# Altium schematic sheet NGUYENLYSANPHAMBAOTRAN.SchDoc
size A2; SheetNumber: 1; SheetTotal: 1
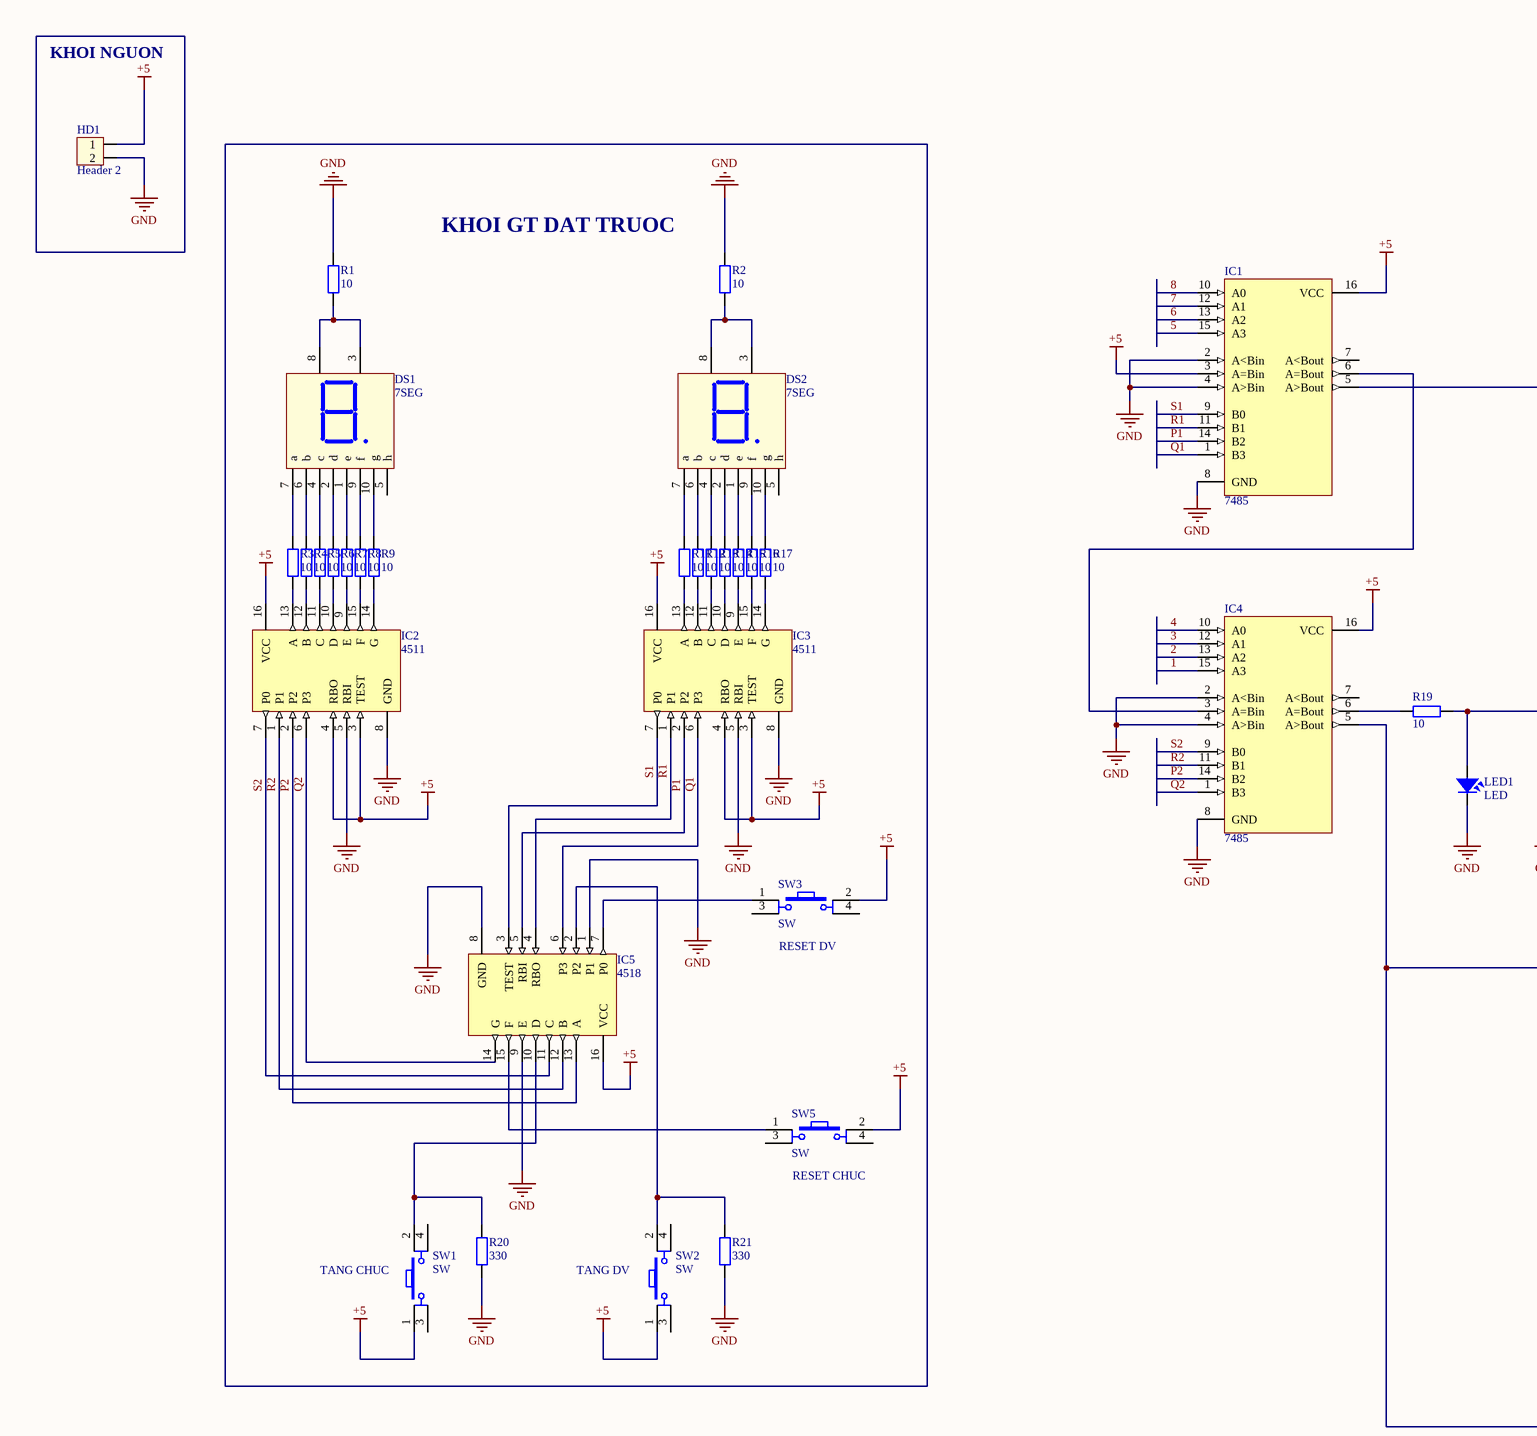
[diagram p0: NGUYENLYSANPHAMBAOTRAN.SchDoc, left]
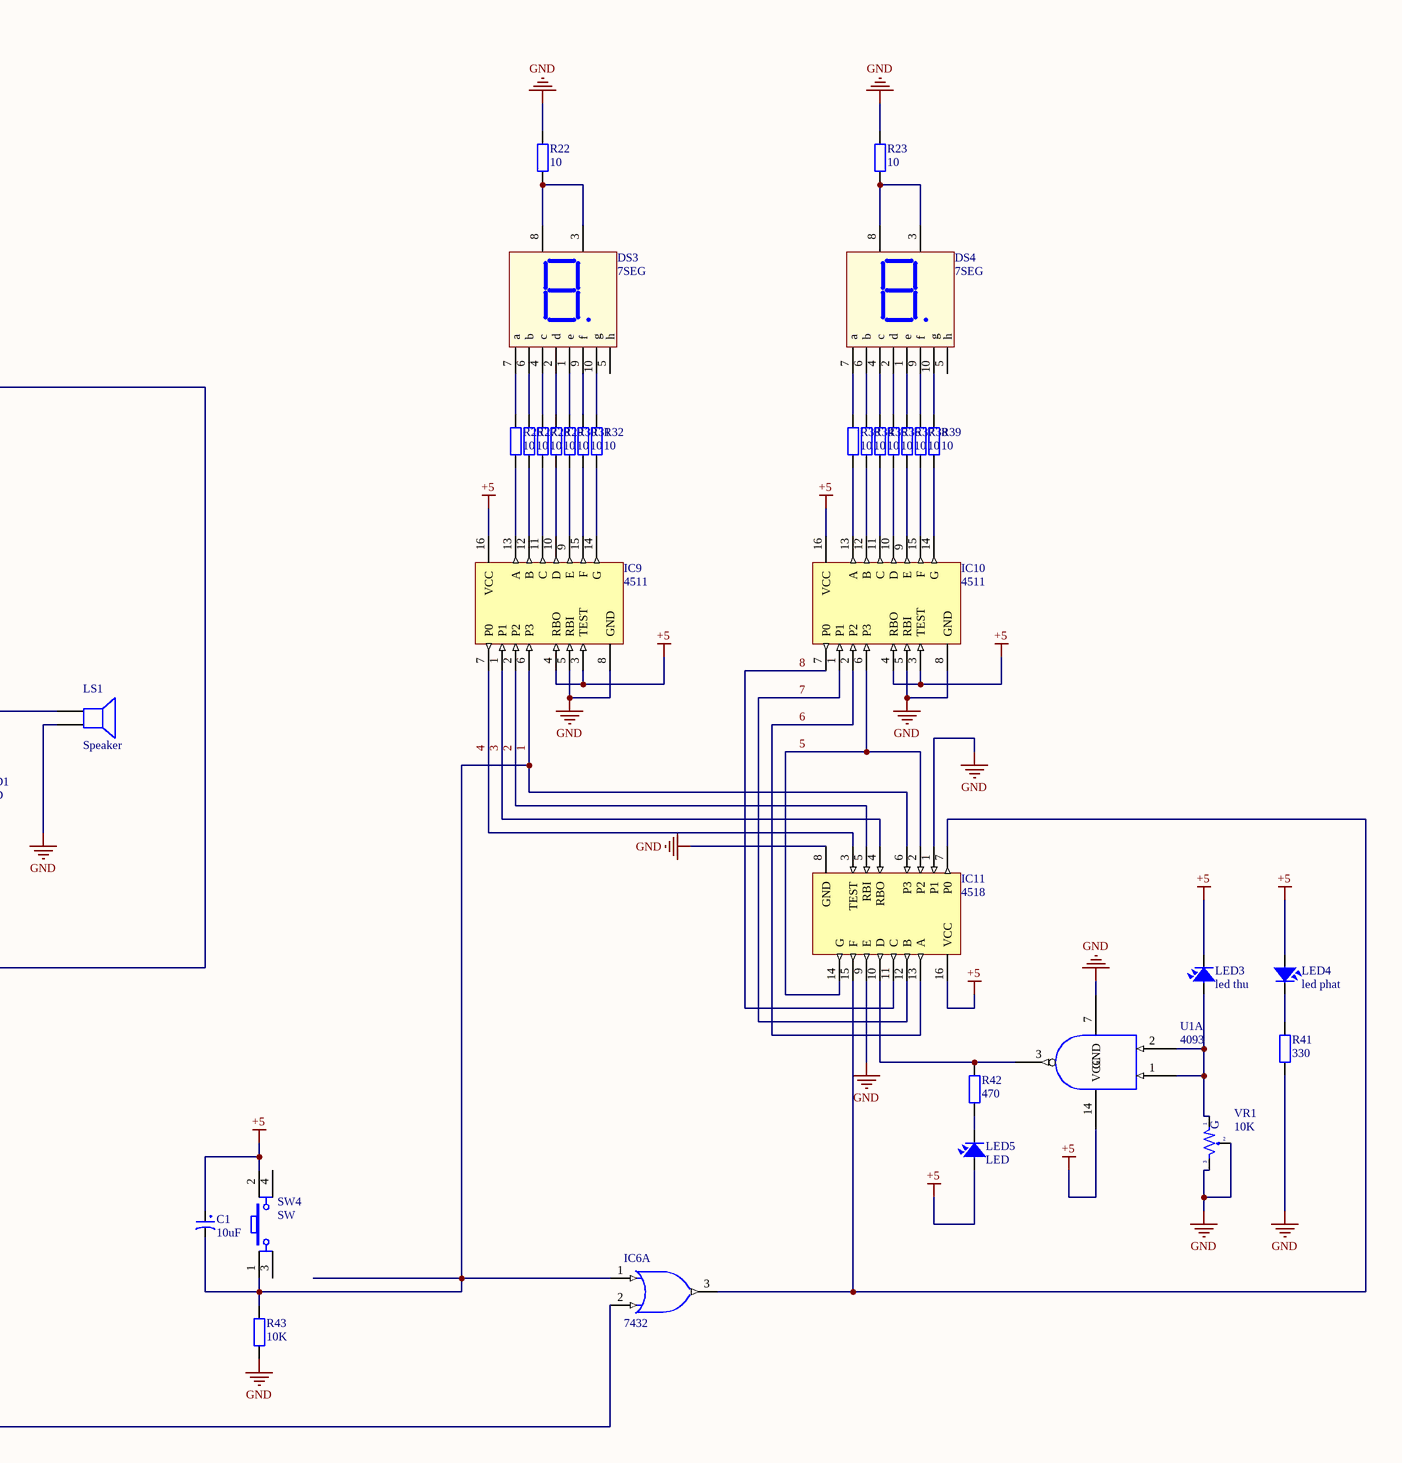
[diagram p1: NGUYENLYSANPHAMBAOTRAN.SchDoc, right]

## Parts
C1  10uF  [tu hoa 4mm]
DS1  7SEG  [LED7SEG-1-0.56]
DS2  7SEG  [LED7SEG-1-0.56]
DS3  7SEG  [LED7SEG-1-0.56]
DS4  7SEG  [LED7SEG-1-0.56]
HD1  Header 2  [HED2]
IC1  7485  [DIP16/W0.3]
IC2  4511  [DIP16]
IC3  4511  [DIP16]
IC4  7485  [DIP16/W0.3]
IC5  4518  [DIP16]
IC6  7432  [DIP14/W0.3]  (part A of 4)
IC9  4511  [DIP16]
IC10  4511  [DIP16]
IC11  4518  [DIP16]
LED1  LED  [LED-3]
LED3  led thu  [LED-3]
LED4  led phat  [LED-3]
LED5  LED  [LED-3]
LS1  Speaker  [SPEAKER]
R1  10  [R1/4W]
R2  10  [R1/4W]
R3  10  [R1/4W]
R4  10  [R1/4W]
R5  10  [R1/4W]
R6  10  [R1/4W]
R7  10  [R1/4W]
R8  10  [R1/4W]
R9  10  [R1/4W]
R11  10  [R1/4W]
R12  10  [R1/4W]
R13  10  [R1/4W]
R14  10  [R1/4W]
R15  10  [R1/4W]
R16  10  [R1/4W]
R17  10  [R1/4W]
R19  10  [R1/4W]
R20  330  [R1/4W]
R21  330  [R1/4W]
R22  10  [R1/4W]
R23  10  [R1/4W]
R26  10  [R1/4W]
R27  10  [R1/4W]
R28  10  [R1/4W]
R29  10  [R1/4W]
R30  10  [R1/4W]
R31  10  [R1/4W]
R32  10  [R1/4W]
R33  10  [R1/4W]
R34  10  [R1/4W]
R35  10  [R1/4W]
R36  10  [R1/4W]
R37  10  [R1/4W]
R38  10  [R1/4W]
R39  10  [R1/4W]
R41  330  [R1/4W]
R42  470  [R1/4W]
R43  10K  [R1/4W]
SW1  SW  [SW4]
SW2  SW  [SW4]
SW3  SW  [SW4]
SW4  SW  [SW4]
SW5  SW  [SW4]
U1  4093  [DIP14]  (part A of 4)
VR1  10K  [VR-S1]

## Nets
+5: C1.1 HD1.1 IC1.3(A=Bin) IC1.16(VCC) IC2.3(TEST) IC2.4(RBO) IC2.16(VCC) IC3.3(TEST) IC3.4(RBO) IC3.16(VCC) IC4.16(VCC) IC5.16(VCC) IC9.3(TEST) IC9.4(RBO) IC9.16(VCC) IC10.3(TEST) IC10.4(RBO) IC10.16(VCC) IC11.16(VCC) LED3.2 LED4.1 LED5.1 SW1.1 SW2.1 SW3.2 SW4.2 SW5.2 U1.14(VCC)
GND: HD1.2 IC1.2(A<Bin) IC1.4(A>Bin) IC1.8(GND) IC2.5(RBI) IC2.8(GND) IC3.5(RBI) IC3.8(GND) IC4.2(A<Bin) IC4.4(A>Bin) IC4.8(GND) IC5.1(P1) IC5.8(GND) IC5.9(E) IC6.7(GND) IC9.5(RBI) IC9.8(GND) IC10.5(RBI) IC10.8(GND) IC11.1(P1) IC11.8(GND) IC11.9(E) LED1.2 LS1.2 R1.2 R2.2 R20.1 R21.1 R22.2 R23.2 R41.1 R43.2 U1.7(GND) VR1.2 VR1.3
VCC: IC6.14(VCC)
1: C1.2 IC4.15(A3) IC6.1(A) IC9.6(P3) IC11.6(P3) R43.1 SW4.1
2: IC4.13(A2) IC9.2(P2) IC11.5(RBI)
3: IC4.12(A1) IC9.1(P1) IC11.4(RBO)
4: IC4.10(A0) IC9.7(P0) IC11.3(TEST)
5: IC1.15(A3) IC10.6(P3) IC11.2(P2) IC11.14(G)
6: IC1.13(A2) IC10.2(P2) IC11.13(A)
7: IC1.12(A1) IC10.1(P1) IC11.12(B)
8: IC1.10(A0) IC10.7(P0) IC11.11(C)
P1: IC1.14(B2) IC3.2(P2) IC5.5(RBI)
P2: IC2.2(P2) IC4.14(B2) IC5.13(A)
Q1: IC1.1(B3) IC3.6(P3) IC5.6(P3)
Q2: IC2.6(P3) IC4.1(B3) IC5.14(G)
R1: IC1.11(B1) IC3.1(P1) IC5.4(RBO)
R2: IC2.1(P1) IC4.11(B1) IC5.12(B)
S1: IC1.9(B0) IC3.7(P0) IC5.3(TEST)
S2: IC2.7(P0) IC4.9(B0) IC5.11(C)
NetDS1_1: DS1.1(e) R7.2
NetDS1_2: DS1.2(d) R6.2
NetDS1_3: DS1.3(Vcc) DS1.8(Vcc) R1.1
NetDS1_4: DS1.4(c) R5.2
NetDS1_6: DS1.6(b) R4.2
NetDS1_7: DS1.7(a) R3.2
NetDS1_9: DS1.9(f) R8.2
NetDS1_10: DS1.10(g) R9.2
NetDS2_1: DS2.1(e) R15.2
NetDS2_2: DS2.2(d) R14.2
NetDS2_3: DS2.3(Vcc) DS2.8(Vcc) R2.1
NetDS2_4: DS2.4(c) R13.2
NetDS2_6: DS2.6(b) R12.2
NetDS2_7: DS2.7(a) R11.2
NetDS2_9: DS2.9(f) R16.2
NetDS2_10: DS2.10(g) R17.2
NetDS3_1: DS3.1(e) R30.2
NetDS3_2: DS3.2(d) R29.2
NetDS3_3: DS3.3(Vcc) DS3.8(Vcc) R22.1
NetDS3_4: DS3.4(c) R28.2
NetDS3_6: DS3.6(b) R27.2
NetDS3_7: DS3.7(a) R26.2
NetDS3_9: DS3.9(f) R31.2
NetDS3_10: DS3.10(g) R32.2
NetDS4_1: DS4.1(e) R37.2
NetDS4_2: DS4.2(d) R36.2
NetDS4_3: DS4.3(Vcc) DS4.8(Vcc) R23.1
NetDS4_4: DS4.4(c) R35.2
NetDS4_6: DS4.6(b) R34.2
NetDS4_7: DS4.7(a) R33.2
NetDS4_9: DS4.9(f) R38.2
NetDS4_10: DS4.10(g) R39.2
NetIC1_5: IC1.5(A>Bout) IC4.5(A>Bout) IC6.2(B)
NetIC1_6: IC1.6(A=Bout) IC4.3(A=Bin)
NetIC2_9: IC2.9(E) R7.1
NetIC2_10: IC2.10(D) R6.1
NetIC2_11: IC2.11(C) R5.1
NetIC2_12: IC2.12(B) R4.1
NetIC2_13: IC2.13(A) R3.1
NetIC2_14: IC2.14(G) R9.1
NetIC2_15: IC2.15(F) R8.1
NetIC3_9: IC3.9(E) R15.1
NetIC3_10: IC3.10(D) R14.1
NetIC3_11: IC3.11(C) R13.1
NetIC3_12: IC3.12(B) R12.1
NetIC3_13: IC3.13(A) R11.1
NetIC3_14: IC3.14(G) R17.1
NetIC3_15: IC3.15(F) R16.1
NetIC4_6: IC4.6(A=Bout) R19.2
NetIC5_2: IC5.2(P2) R21.2 SW2.2
NetIC5_7: IC5.7(P0) SW3.1
NetIC5_10: IC5.10(D) R20.2 SW1.2
NetIC5_15: IC5.15(F) SW5.1
NetIC6_3: IC6.3(Y) IC11.7(P0) IC11.15(F)
NetIC9_9: IC9.9(E) R30.1
NetIC9_10: IC9.10(D) R29.1
NetIC9_11: IC9.11(C) R28.1
NetIC9_12: IC9.12(B) R27.1
NetIC9_13: IC9.13(A) R26.1
NetIC9_14: IC9.14(G) R32.1
NetIC9_15: IC9.15(F) R31.1
NetIC10_9: IC10.9(E) R37.1
NetIC10_10: IC10.10(D) R36.1
NetIC10_11: IC10.11(C) R35.1
NetIC10_12: IC10.12(B) R34.1
NetIC10_13: IC10.13(A) R33.1
NetIC10_14: IC10.14(G) R39.1
NetIC10_15: IC10.15(F) R38.1
NetIC11_10: IC11.10(D) R42.2 U1.3
NetLED1_1: LED1.1 LS1.1 R19.1
NetLED3_1: LED3.1 U1.1 U1.2 VR1.1
NetLED4_2: LED4.2 R41.2
NetLED5_2: LED5.2 R42.1

Not connected (* = marked no-connect by the designer): DS1 5(h); DS2 5(h); DS3 5(h); DS4 5(h); IC1 7(A<Bout); IC4 7(A<Bout); SW1 3 4; SW2 3 4; SW3 3 4; SW4 3 4; SW5 3 4

## Notes on the sheet
- KHOI NGUON
- KHOI GT DAT TRUOC
- (near SW3) RESET DV
- (near SW5) RESET CHUC
- (near SW1) TANG CHUC
- (near SW2) TANG DV
- (in symbol VR-S) G

## Library data of the parts
C1 = Tu Hoa 10uF 25V 4x7: Cắm; So_Chan: 2; Ten_Linh_Kien: Tụ Hóa 10uF 25V 4x7MM; Don_Vi: Con; Ma_Hang: MH001349; Chung_Loai: Cắm; Kieu_Chan: *
DS1-DS4 = LED7SEG-1: 14.2 mm General Purpose Blue 7-Segment Display: CC, RH DP, Gray Surface; MinimumIntensity: 2020 ucd; Note: IF = 10 mA; Published: 8-Jun-2000; LatestRevisionDate: 17-Dec-2003; LatestRevisionNote: Schematic revised, PCB Footprint replaced.; DatasheetDocument: 24-Sep-2002; PackageDocument: 24-Sep-2002; PackageReference: H; Publisher: Altium Limited; Colour: Blue; ComponentLink1Description: Manufacturer Link; ComponentLink1URL: http://www.agilent.com/
HD1 = Hed2: Header 2 (Green); Value: Header 2
IC1 IC4 = 7485: 4-Bit Magnitude Comparator; Copyright by: VanDungEvn@Gmail.com; Value: 7485
IC2 IC3 IC5 IC9-IC11 = 74247: Value: 74LS238; Copyright by: VanDungEvn@Gmail.com
IC6 = 7432: Quad 2-Input OR Gate
LED1 LED3-LED5 = LED: LED Single colour Green and Red; Value: LED 3 ly Single Colour
LS1 = Speaker: Loudspeaker; Published: 24-Mar-1999; LatestRevisionDate: 17-Jul-2002; LatestRevisionNote: Re-released for DXP Platform.; PackageReference: PIN2; Publisher: Altium Limited
R1-R9 R11-R17 R19-R23 R26-R39 R41-R43 = R1/4W: Resistor 1/4W; Value: R1/4W - 1K
SW1-SW5 = SW4: Switch button 4 pin; Value: Button chip 4 pin
U1 = 4093: Quad 2-INPUT NAND SCHMITT TRIGGER
VR1 = VR-S: Var Resistor; Value: Volume 50k